# EAGLE design module-rs232 (EAGLE 4.16)
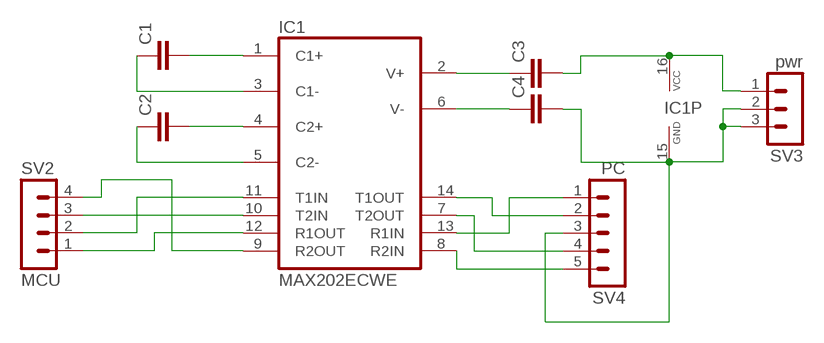
[diagram p0: schematic, sheet 1]

## Parts
C1  C-EUC0805  [C0805]
C2  C-EUC0805  [C0805]
C3  C-EUC0805  [C0805]
C4  C-EUC0805  [C0805]
IC1  MAX202ECWE  [SO16L]
SV2  MCU  MA04-1  [MA04-1]
SV3  pwr  MA03-1  [MA03-1]
SV4  PC  MA05-1  [MA05-1]

## Nets
GND: C4.2 IC1.15(GND) SV3.2 SV3.3 SV4.3
N$1: C1.2 IC1.1(C1+)
N$2: C1.1 IC1.3(C1-)
N$3: C2.2 IC1.4(C2+)
N$4: C2.1 IC1.5(C2-)
N$5: C3.1 IC1.2(V+)
N$6: C4.1 IC1.6(V-)
N$9: IC1.13(R1IN) SV4.1
N$10: IC1.14(T1OUT) SV4.2
N$11: IC1.8(R2IN) SV4.5
N$12: IC1.7(T2OUT) SV4.4
N$13: IC1.12(R1OUT) SV2.1
N$14: IC1.11(T1IN) SV2.2
N$15: IC1.9(R2OUT) SV2.4
N$16: IC1.10(T2IN) SV2.3
VCC: C3.2 IC1.16(VCC) SV3.1

## Library data of the parts
C1-C4 = rcl:C-EU: CAPACITOR, European symbol
IC1 = maxim:MAX202ECWE: RS232 TRANSEIVER
SV2 = con-lstb:MA04-1: PIN HEADER
SV3 = con-lstb:MA03-1: PIN HEADER
SV4 = con-lstb:MA05-1: PIN HEADER

## Board
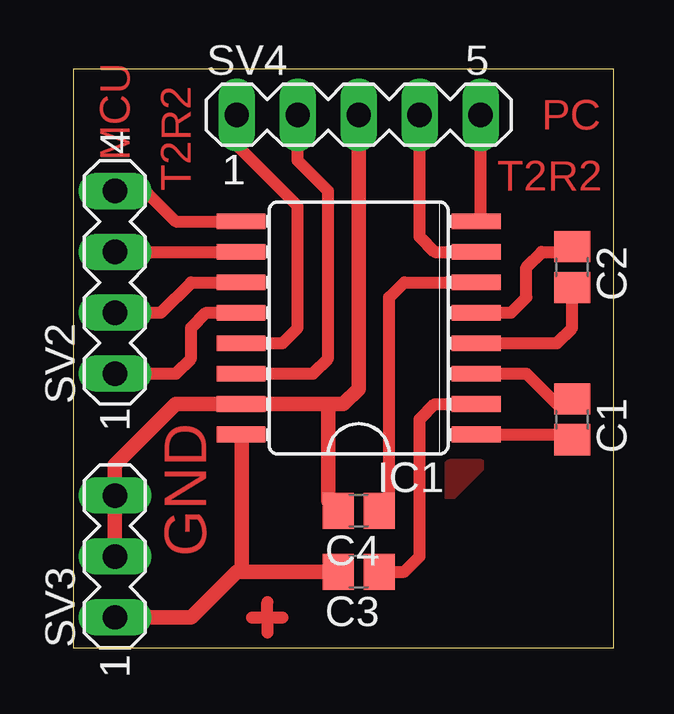
[diagram p1: board, top side]

Size 22.53 x 24.12 mm. Coordinates in mm from the lower left corner, seen from the top.
Outline: 0,0 22.53,0 22.53,24.12 0,24.12 0,0
Copper layers (1*16): Top 0.035mm / dielectric 1.5mm / Bottom 0.035mm
Design rules "default": minimum track width 10mil, minimum drill 24mil, track to track 8mil, track to pad 8mil, pad to pad 8mil, via to via 8mil, smd to smd 8mil, copper to edge 40mil, drill to drill 8mil, minimum pad ring 10mil, minimum via ring 8mil, stop-mask expansion 4mil, vias tented up to drill 0mil, thermal gap 10mil

### Footprints (pad centres in the part's own frame; a part is rotated, then mirrored left to right if it is on the bottom)
C0805 = smd 1.3 x 1.5: 1 -0.85,0; 2 0.85,0
SO16L = smd 0.66 x 2.032: 1 -4.445,-4.902; 2 -3.175,-4.902; 3 -1.905,-4.902; 4 -0.635,-4.902; 5 0.635,-4.902; 6 1.905,-4.902; 7 3.175,-4.902; 8 4.445,-4.902; 9 4.445,4.902; 10 3.175,4.902; 11 1.905,4.902; 12 0.635,4.902; 13 -0.635,4.902; 14 -1.905,4.902; 15 -3.175,4.902; 16 -4.445,4.902
MA04-1 = drill 1.016 long: 1 -3.81,0; 2 -1.27,0; 3 1.27,0; 4 3.81,0
MA03-1 = drill 1.016 long: 1 -2.54,0; 2 0,0; 3 2.54,0
MA05-1 = drill 1.016 long: 1 -5.08,0; 2 -2.54,0; 3 0,0; 4 2.54,0; 5 5.08,0

### Placement (x,y rotation side)
C1  20.79,9.52 270 top
C2  20.79,15.87 270 top
C3  11.9,3.17 180 top
C4  11.9,5.71 180 top
IC1  11.9,13.33 90 top
SV2  1.74,15.23 90 top
SV3  1.74,3.81 90 top
SV4  11.9,22.22 0 top

### Tracks (layer width: path | path; a pad name or v marks a point on that pad's centre or on a via)
GND
  Top 0.508: 10.63,6.13 C4.2 | IC1.15 6.82,10.15
  Top 0.61: 10.63,10.15 IC1.15 4.28,10.15 1.74,7.62 SV3.3 SV3.2 | 10.63,10.15 10.63,6.13 | 10.63,10.15 11.27,10.15 11.9,10.79 SV4.3
N$1
  Top 0.508: C1.2 20.79,8.88 IC1.1
N$2
  Top 0.508: IC1.3 18.89,11.42 20.16,10.15 20.79,10.15 C1.1
N$3
  Top 0.508: IC1.4 20.16,12.7 20.79,13.33 C2.2 20.79,15.23
N$4
  Top 0.508: IC1.5 18.25,13.96 18.89,14.6 18.89,15.87 19.52,16.5 20.79,16.5 C2.1
N$5
  Top 0.508: 16.98,10.15 IC1.2 15.07,10.15 14.44,9.52 14.44,3.81 13.8,3.17 C3.1 12.54,3.17
N$6
  Top 0.508: 16.98,15.23 IC1.6 15.71,15.23 | 15.71,15.23 15.58,15.23 | C4.1 13.17,5.93 13.17,14.6 13.8,15.23 15.71,15.23
N$7
  pour Top (isolate 0.254, no thermals): 15.71,7.62 15.71,6.35 16.98,7.62
N$8
  Top 0.508: 8.09,1.27 8.09,1.9 | 8.09,1.27 8.09,0.63 | 7.45,1.27 8.09,1.27 | 8.09,1.27 8.73,1.27
N$9
  Top 0.508: IC1.13 6.82,12.7 | IC1.13 8.22,12.7 | IC1.13 8.73,12.7 9.36,13.33 9.36,18.41 6.82,20.95 SV4.1
N$10
  Top 0.508: IC1.14 10,11.42 10.63,12.06 10.63,19.04 9.36,20.31 SV4.2
N$11
  Top 0.508: 16.34,17.77 IC1.8 16.98,17.77 SV4.5
N$12
  Top 0.508: 16.98,16.5 IC1.7 15.07,16.5 14.44,17.14 SV4.4
N$13
  Top 0.508: IC1.12 5.55,13.96 4.92,13.33 4.92,12.06 4.28,11.42 SV2.1
N$14
  Top 0.508: IC1.11 4.92,15.23 3.65,13.96 SV2.2
N$15
  Top 0.508: IC1.9 4.28,17.77 3.01,19.04 SV2.4
N$16
  Top 0.508: SV2.3 IC1.10
VCC
  Top 0.508: 7.02,8.61 IC1.16 6.82,8.88 7.02,8.68 | 7.02,3.17 6.82,3.17
  Top 0.61: C3.2 7.02,3.17 7.02,8.68 | SV3.1 4.92,1.27 6.82,3.17

### Text on the board
Top: PC | MCU | T2R2 | T2R2 | GND